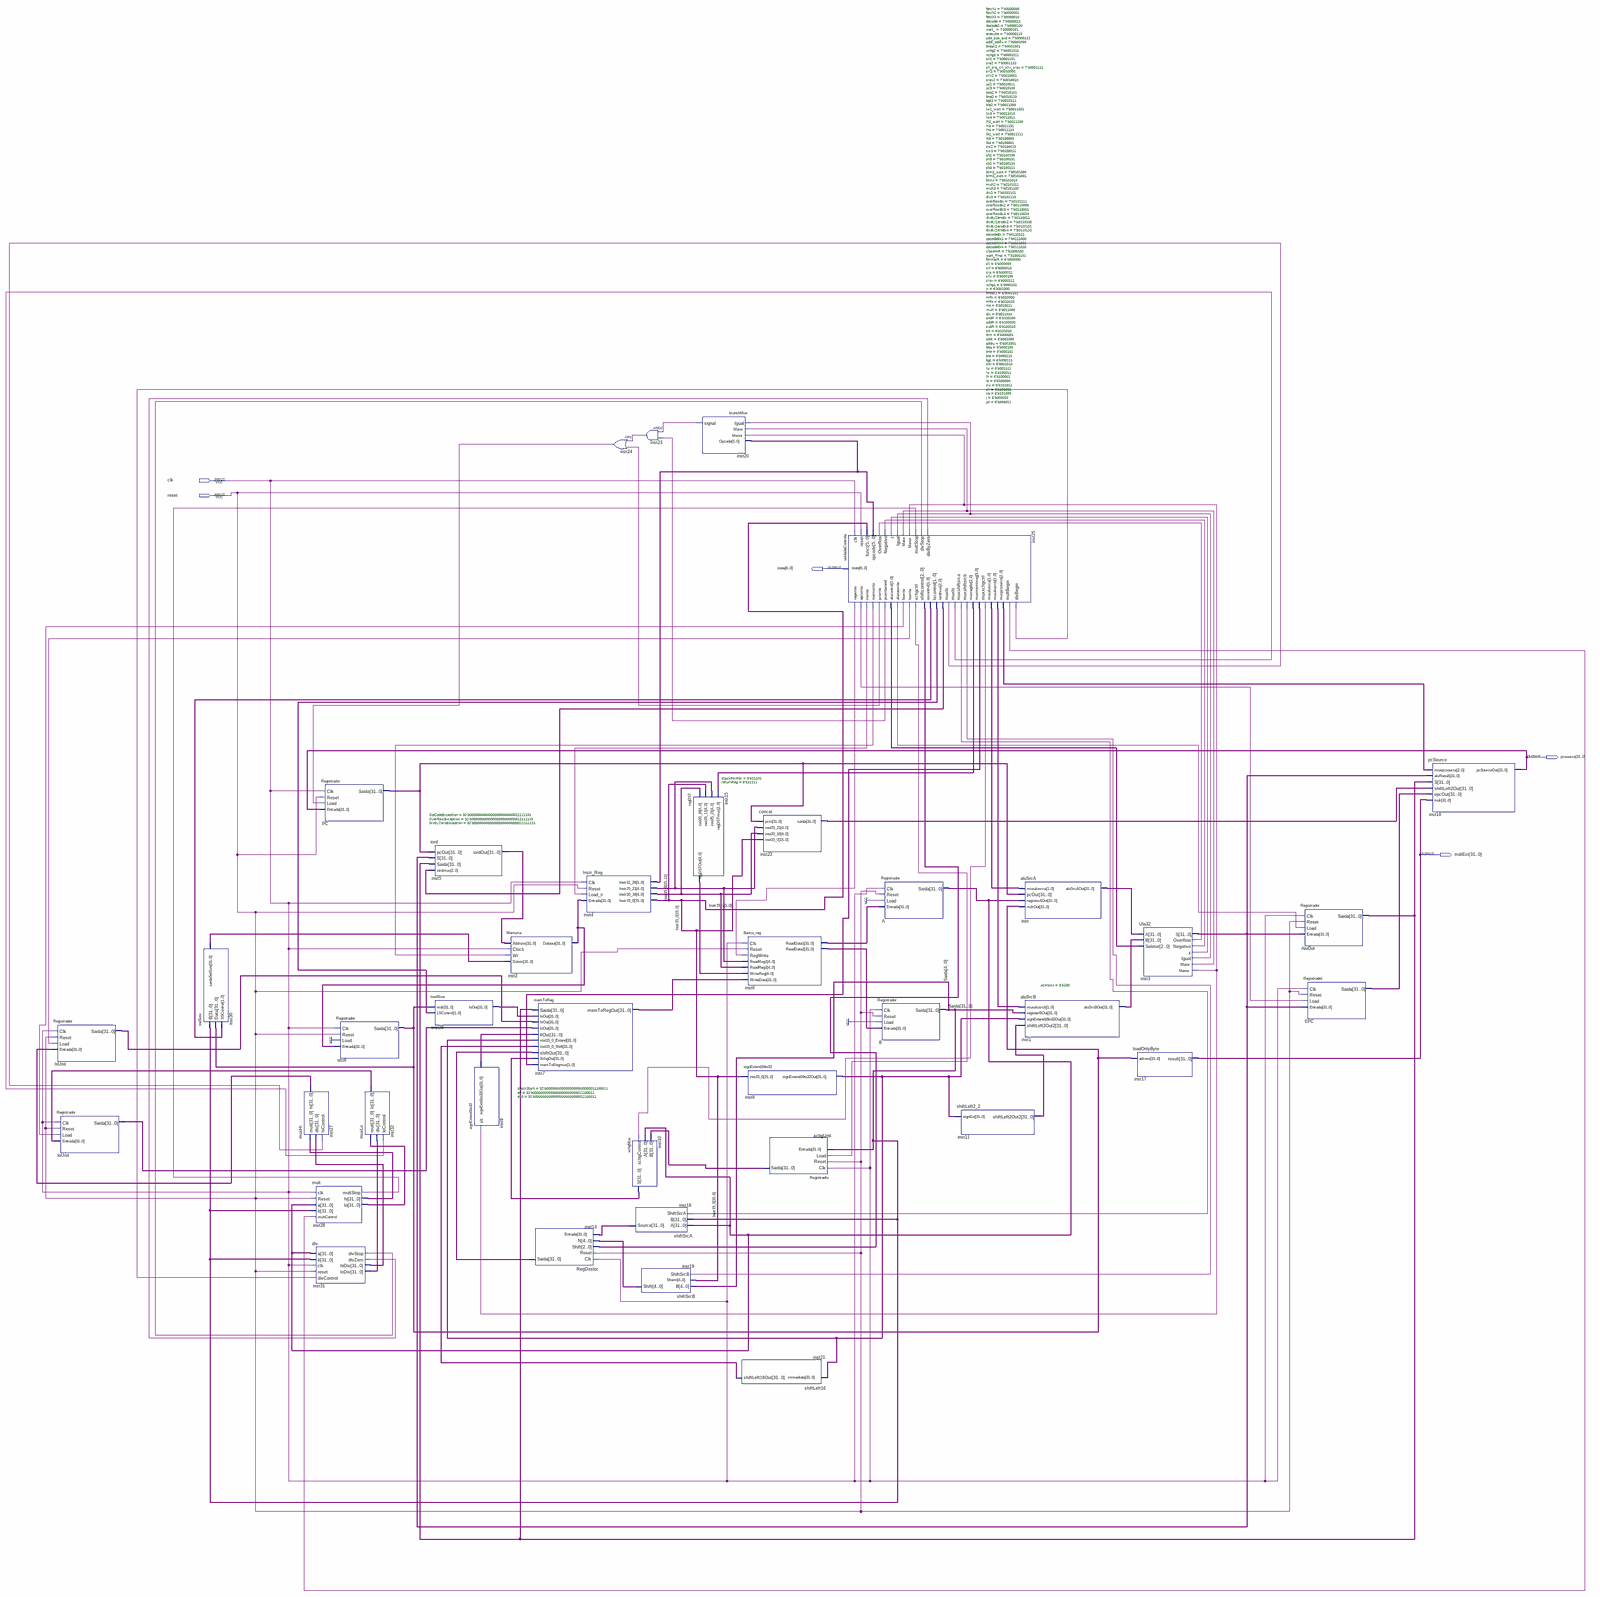
[diagram p0: schematic sheet, whole]
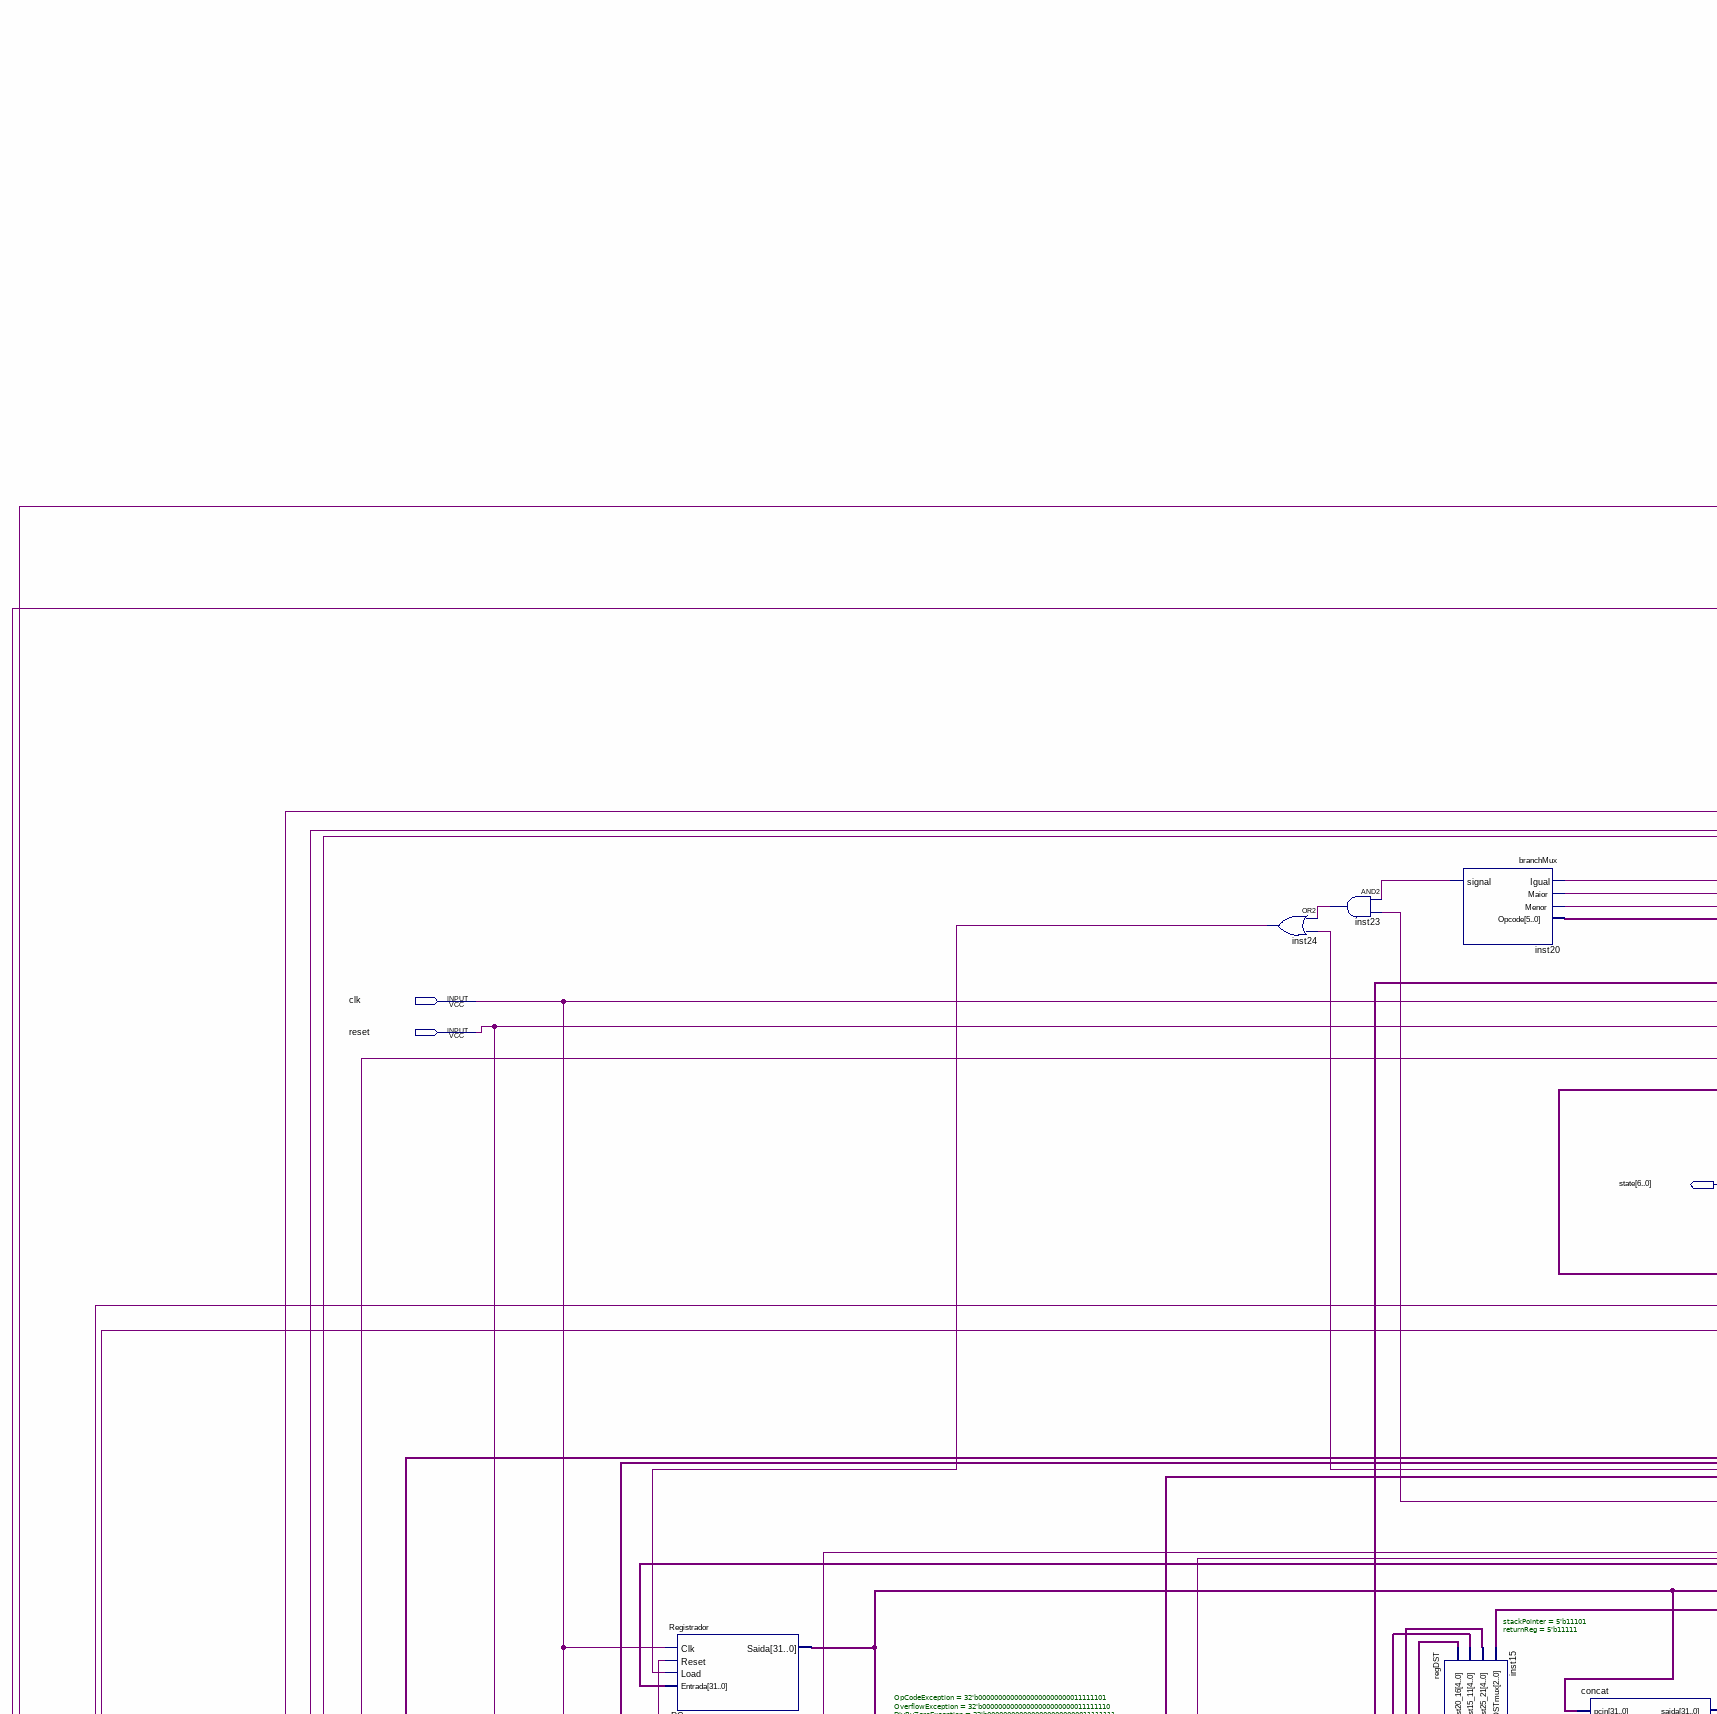
[diagram p1: schematic sheet, upper left part]
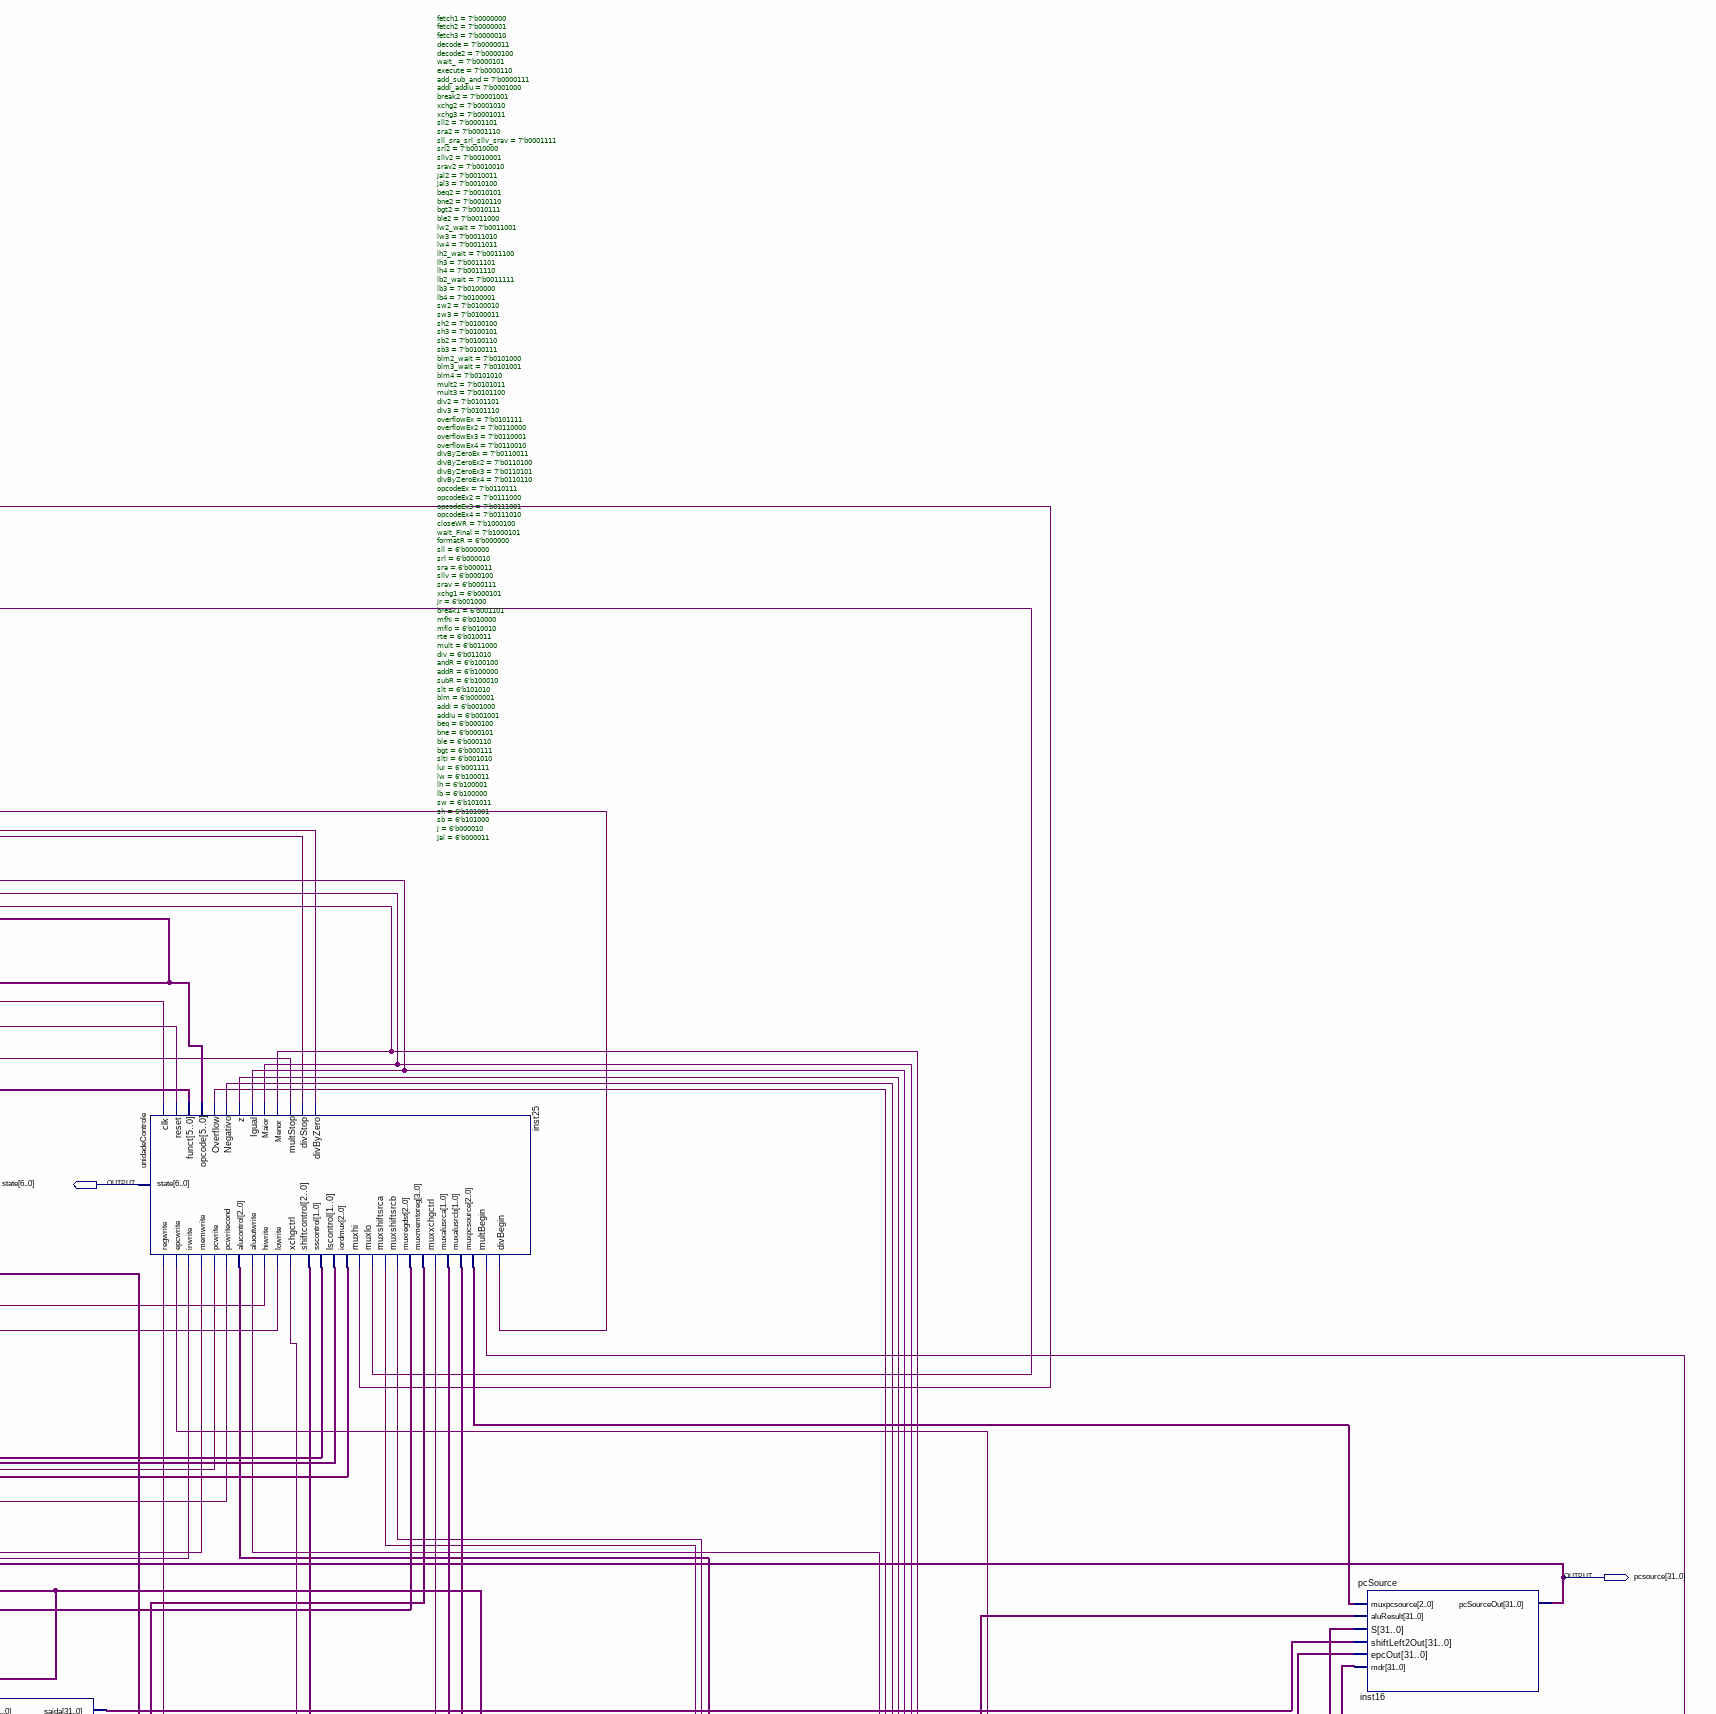
[diagram p2: schematic sheet, upper right part]
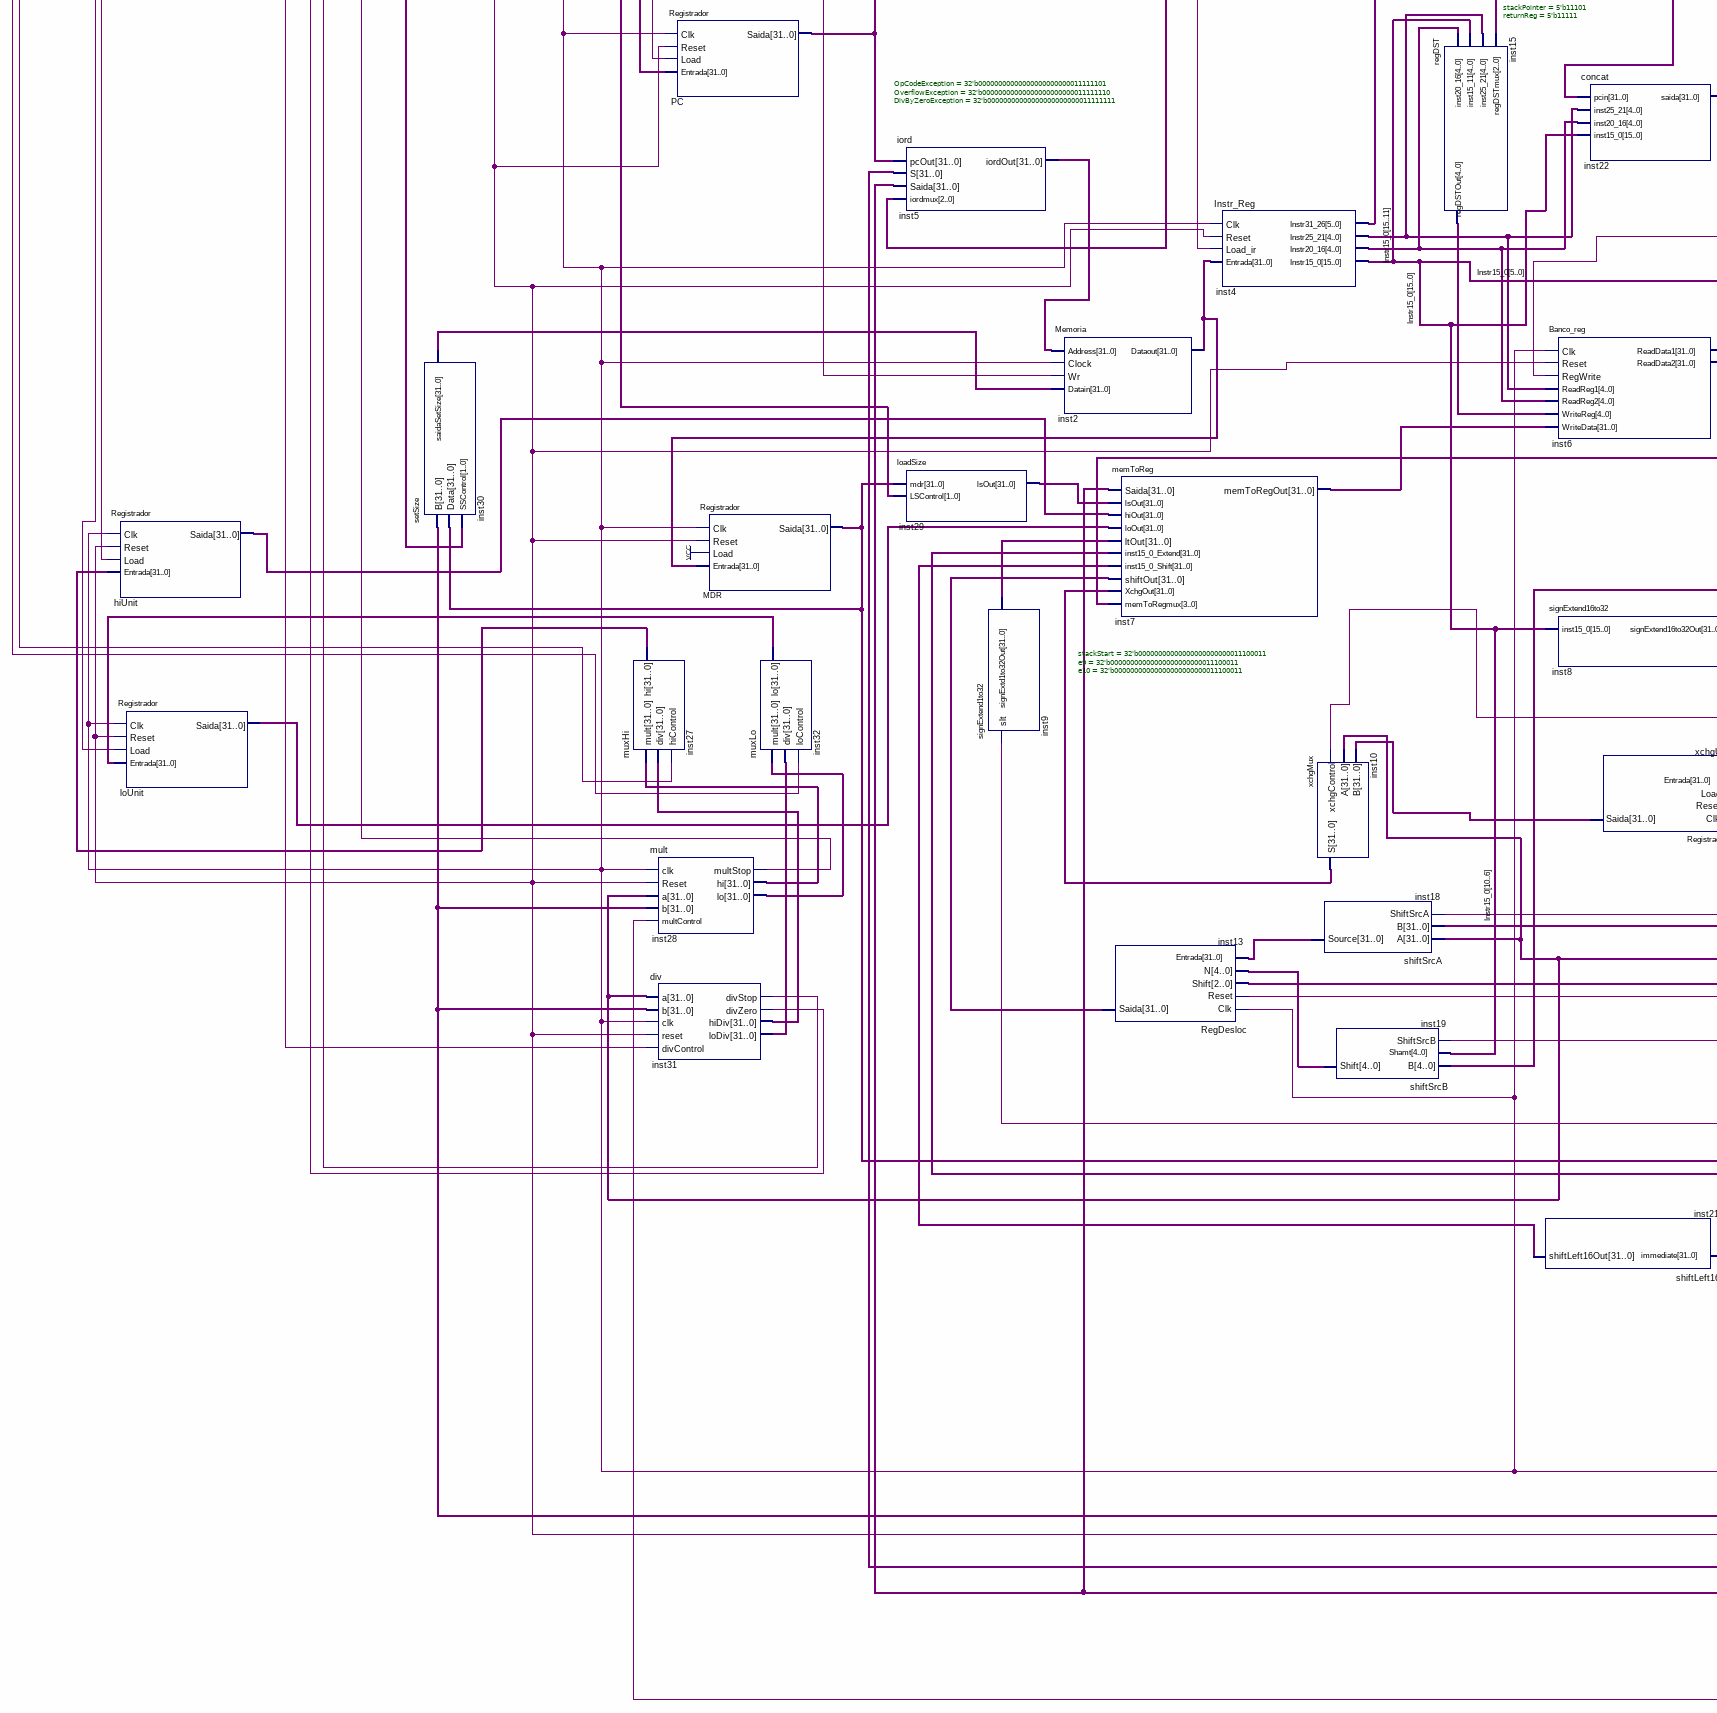
[diagram p3: schematic sheet, lower left part]
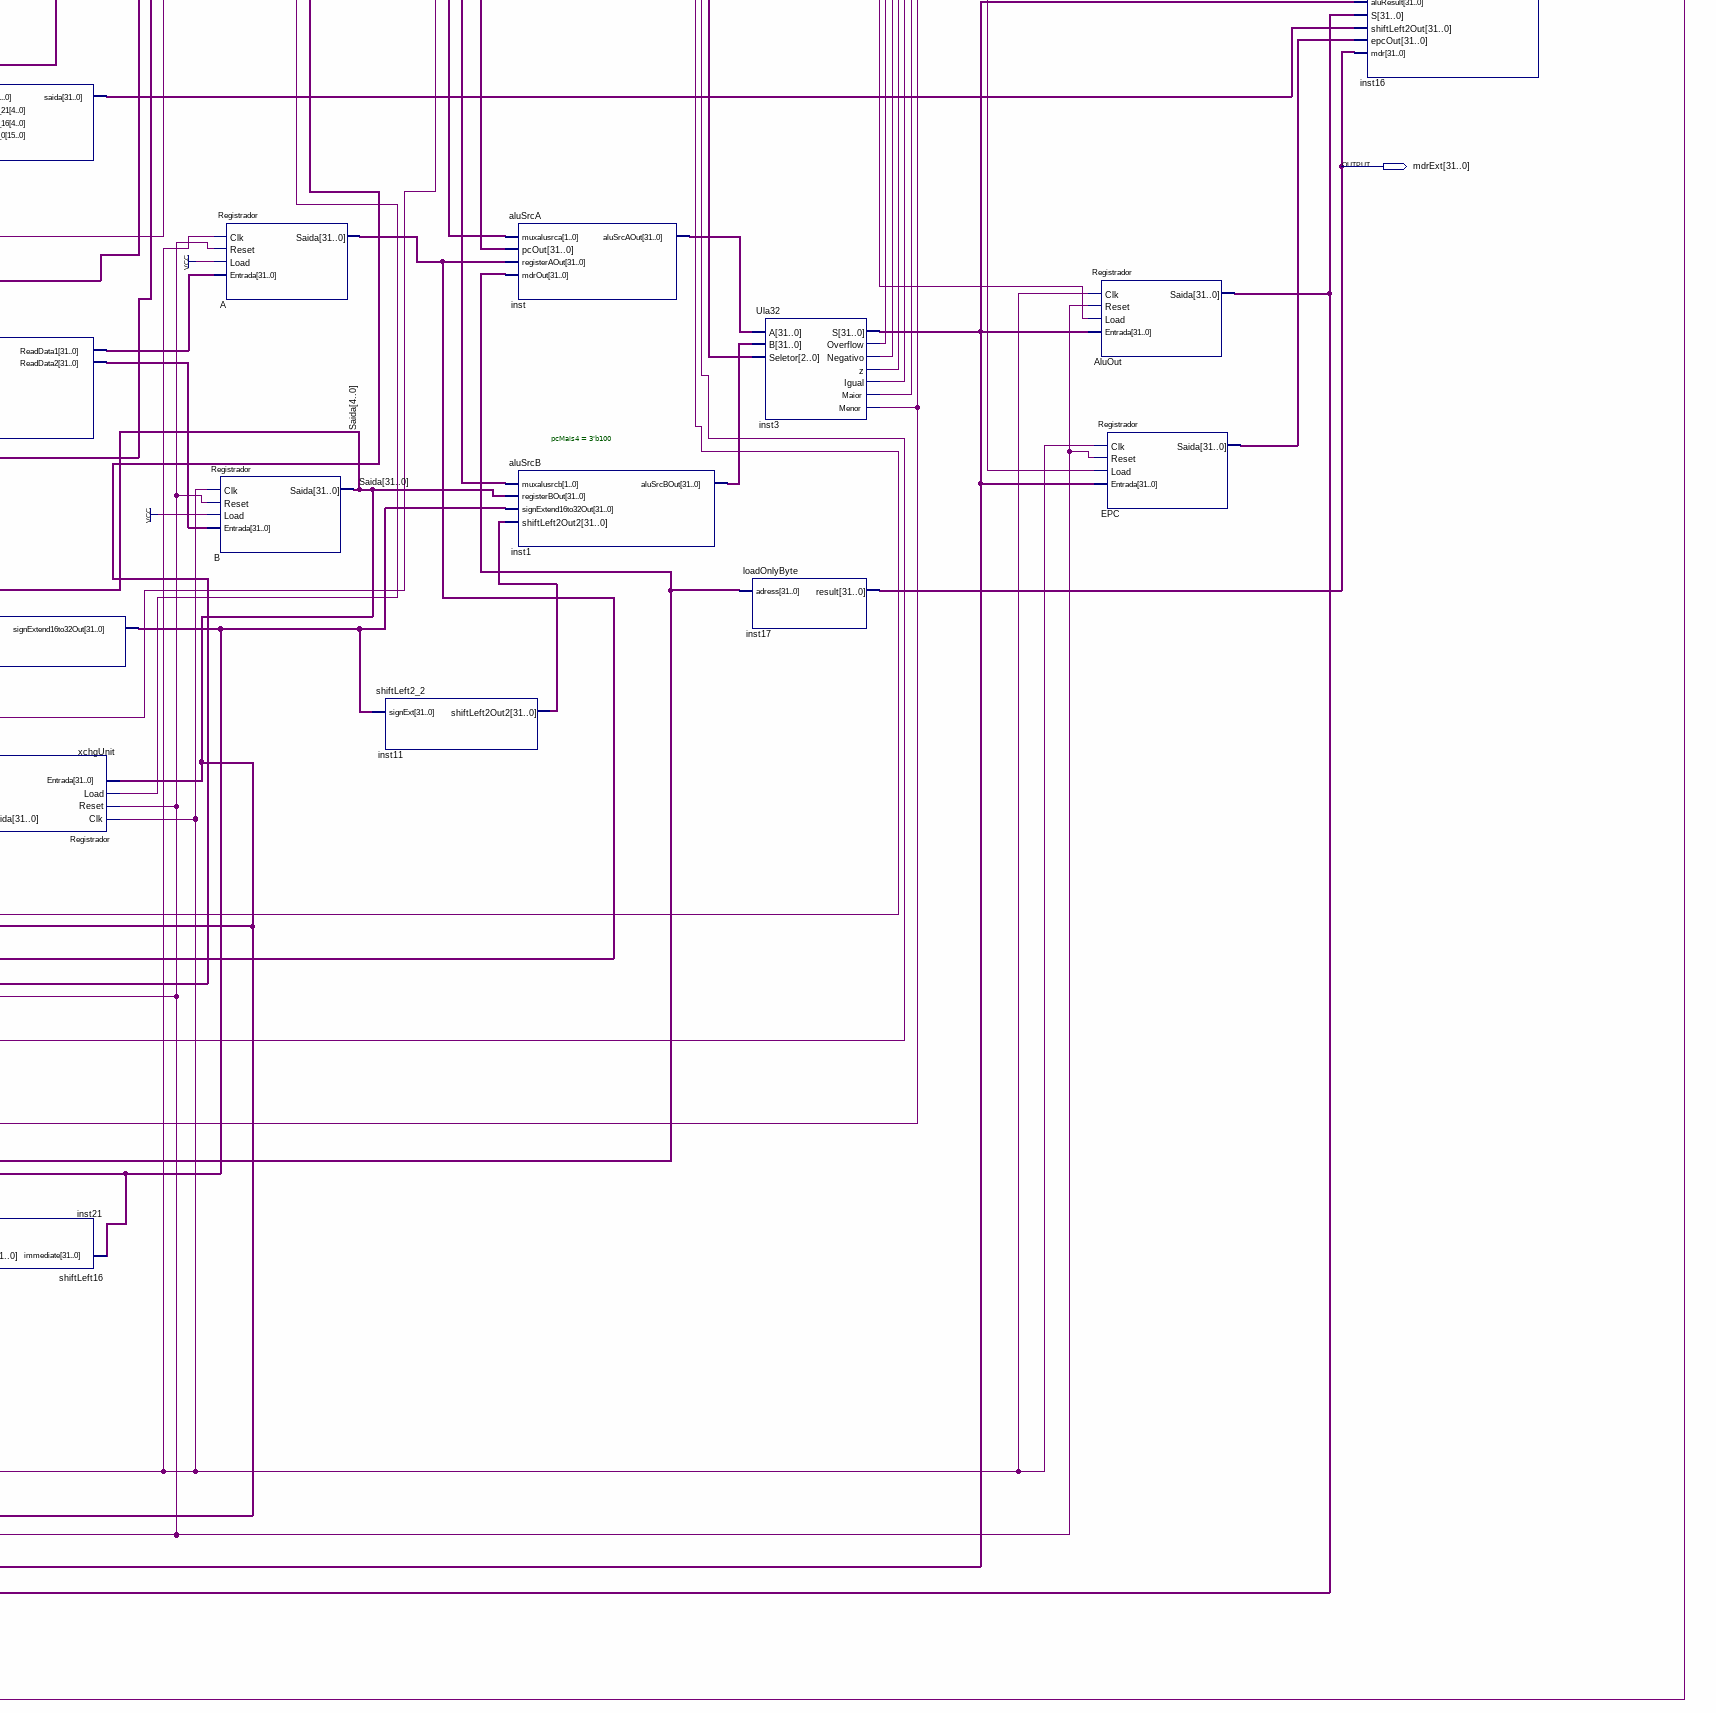
[diagram p4: schematic sheet, lower right part]
// Quartus schematic schemeHard.bdf as structural Verilog: 39 symbols, 5 pins
module schemeHard (
  input  clk,
  input  reset,
  output [6:0] state,
  output [31:0] pcsource,
  output [31:0] mdrExt
);

  wire inst3_igual, inst3_maior, inst3_menor, inst3_negativo, inst3_overflow, inst3_z, inst20_signal,
       inst23_out, inst24_out, inst25_aluoutwrite, inst25_divbegin, inst25_epcwrite, inst25_hiwrite,
       inst25_irwrite, inst25_lowrite, inst25_memwrite, inst25_multbegin, inst25_muxhi, inst25_muxlo,
       inst25_muxshiftsrca, inst25_muxshiftsrcb, inst25_muxxchgctrl, inst25_pcwrite, inst25_pcwritecond,
       inst25_regwrite, inst25_xchgctrl, inst28_multstop, inst31_divstop, inst31_divzero;
  wire [1:0] inst25_lscontrol, inst25_muxalusrca, inst25_muxalusrcb, inst25_sscontrol;
  wire [2:0] inst25_alucontrol, inst25_iordmux, inst25_muxpcsource, inst25_muxregdst, inst25_shiftcontrol;
  wire [3:0] inst25_muxmemtoreg;
  wire [4:0] inst4_instr20_16, inst4_instr25_21, inst15_regdstout, inst19_shift;
  wire [5:0] inst4_instr31_26;
  wire [15:0] Instr15_0;
  wire [31:0] A_saida, AluOut_saida, EPC_saida, hiUnit_saida, inst1_alusrcbout, inst2_dataout, inst3_s,
       inst5_iordout, inst6_readdata1, inst6_readdata2, inst7_memtoregout, inst8_signextend16to32out,
       inst9_signextd1to32out, inst10_s, inst11_shiftleft2out2, inst13_saida, inst18_source,
       inst21_shiftleft16out, inst22_saida, inst27_hi, inst28_hi, inst28_lo, inst29_lsout,
       inst30_saidasetsize, inst31_hidiv, inst31_lodiv, inst32_lo, inst_alusrcaout, loUnit_saida, MDR_saida,
       PC_saida, Saida, xchgUnit_saida;

  Registrador hiUnit (.Clk(clk), .Reset(reset), .Load(inst25_lowrite), .Entrada(inst27_hi), .Saida(hiUnit_saida));
  Registrador loUnit (.Clk(clk), .Reset(reset), .Load(inst25_hiwrite), .Entrada(inst32_lo), .Saida(loUnit_saida));
  setSize inst30 (.B(Saida), .Data(MDR_saida), .SSControl(inst25_sscontrol), .saidaSetSize(inst30_saidasetsize));
  muxHi inst27 (.mult(inst28_hi), .div(inst31_hidiv), .hiControl(inst25_muxhi), .hi(inst27_hi));
  Registrador PC (.Clk(clk), .Reset(reset), .Load(inst24_out), .Entrada(pcsource), .Saida(PC_saida));
  mult inst28 (
    .clk(clk), .Reset(reset), .a(A_saida), .b(Saida), .multControl(inst25_multbegin),
    .multStop(inst28_multstop), .hi(inst28_hi), .lo(inst28_lo));
  div inst31 (
    .a(A_saida), .b(Saida), .clk(clk), .reset(reset), .divControl(inst25_divbegin), .divStop(inst31_divstop),
    .divZero(inst31_divzero), .hiDiv(inst31_hidiv), .loDiv(inst31_lodiv));
  Registrador MDR (.Clk(clk), .Reset(reset), .Load(1'b1), .Entrada(inst2_dataout), .Saida(MDR_saida));
  muxLo inst32 (.mult(inst28_lo), .div(inst31_lodiv), .loControl(inst25_muxlo), .lo(inst32_lo));
  iord #(.OpCodeException(32'b00000000000000000000000011111101), .OverflowException(32'b00000000000000000000000011111110), .DivByZeroException(32'b00000000000000000000000011111111)) inst5 (
    .pcOut(PC_saida), .S(inst3_s), .Saida(AluOut_saida), .iordmux(inst25_iordmux), .iordOut(inst5_iordout));
  loadSize inst29 (.mdr(MDR_saida), .LSControl(inst25_lscontrol), .lsOut(inst29_lsout));
  signExtend1to32 inst9 (.slt(inst3_menor), .signExtd1to32Out(inst9_signextd1to32out));
  Memoria inst2 (
    .Address(inst5_iordout), .Clock(clk), .Wr(inst25_memwrite), .Datain(inst30_saidasetsize),
    .Dataout(inst2_dataout));
  memToReg #(.stackStart(32'b00000000000000000000000011100011), .e9(32'b00000000000000000000000011100011), .e10(32'b00000000000000000000000011100011)) inst7 (
    .Saida(AluOut_saida), .lsOut(inst29_lsout), .hiOut(hiUnit_saida), .loOut(loUnit_saida),
    .ltOut(inst9_signextd1to32out), .inst15_0_Extend(inst8_signextend16to32out),
    .inst15_0_Shift(inst21_shiftleft16out), .shiftOut(inst13_saida), .XchgOut(inst10_s),
    .memToRegmux(inst25_muxmemtoreg), .memToRegOut(inst7_memtoregout));
  RegDesloc inst13 (
    .Clk(clk), .Reset(reset), .Shift(inst25_shiftcontrol), .N(inst19_shift), .Entrada(inst18_source),
    .Saida(inst13_saida));
  Instr_Reg inst4 (
    .Clk(clk), .Reset(reset), .Load_ir(inst25_irwrite), .Entrada(inst2_dataout),
    .Instr31_26(inst4_instr31_26), .Instr25_21(inst4_instr25_21), .Instr20_16(inst4_instr20_16),
    .Instr15_0(Instr15_0));
  or inst24 (inst24_out, inst23_out, inst25_pcwrite);
  and inst23 (inst23_out, inst20_signal, inst25_pcwritecond);
  xchgMux inst10 (.xchgControl(inst25_muxxchgctrl), .A(A_saida), .B(xchgUnit_saida), .S(inst10_s));
  shiftSrcA inst18 (.A(A_saida), .B(Saida), .ShiftSrcA(inst25_muxshiftsrca), .Source(inst18_source));
  shiftSrcB inst19 (.B(Saida[4:0]), .Shamt(Instr15_0[10:6]), .ShiftSrcB(inst25_muxshiftsrcb), .Shift(inst19_shift));
  regDST #(.stackPointer(5'b11101), .returnReg(5'b11111)) inst15 (
    .inst20_16(inst4_instr20_16), .inst15_11(Instr15_0[15:11]), .inst25_21(inst4_instr25_21),
    .regDSTmux(inst25_muxregdst), .regDSTOut(inst15_regdstout));
  branchMux inst20 (
    .Igual(inst3_igual), .Maior(inst3_maior), .Menor(inst3_menor), .Opcode(inst4_instr31_26),
    .signal(inst20_signal));
  shiftLeft16 inst21 (.immediate(inst8_signextend16to32out), .shiftLeft16Out(inst21_shiftleft16out));
  concat inst22 (
    .pcin(PC_saida), .inst25_21(inst4_instr25_21), .inst20_16(inst4_instr20_16), .inst15_0(Instr15_0),
    .saida(inst22_saida));
  Banco_reg inst6 (
    .Clk(clk), .Reset(reset), .RegWrite(inst25_regwrite), .ReadReg1(inst4_instr25_21),
    .ReadReg2(inst4_instr20_16), .WriteReg(inst15_regdstout), .WriteData(inst7_memtoregout),
    .ReadData1(inst6_readdata1), .ReadData2(inst6_readdata2));
  signExtend16to32 inst8 (.inst15_0(Instr15_0), .signExtend16to32Out(inst8_signextend16to32out));
  Registrador xchgUnit (.Clk(clk), .Reset(reset), .Load(inst25_xchgctrl), .Entrada(Saida), .Saida(xchgUnit_saida));
  unidadeControle #(.fetch1(7'b0000000), .fetch2(7'b0000001), .fetch3(7'b0000010), .decode(7'b0000011), .decode2(7'b0000100), .wait_(7'b0000101), .execute(7'b0000110), .add_sub_and(7'b0000111), .addi_addiu(7'b0001000), .break2(7'b0001001), .xchg2(7'b0001010), .xchg3(7'b0001011), .sll2(7'b0001101), .sra2(7'b0001110), .sll_sra_srl_sllv_srav(7'b0001111), .srl2(7'b0010000), .sllv2(7'b0010001), .srav2(7'b0010010), .jal2(7'b0010011), .jal3(7'b0010100), .beq2(7'b0010101), .bne2(7'b0010110), .bgt2(7'b0010111), .ble2(7'b0011000), .lw2_wait(7'b0011001), .lw3(7'b0011010), .lw4(7'b0011011), .lh2_wait(7'b0011100), .lh3(7'b0011101), .lh4(7'b0011110), .lb2_wait(7'b0011111), .lb3(7'b0100000), .lb4(7'b0100001), .sw2(7'b0100010), .sw3(7'b0100011), .sh2(7'b0100100), .sh3(7'b0100101), .sb2(7'b0100110), .sb3(7'b0100111), .blm2_wait(7'b0101000), .blm3_wait(7'b0101001), .blm4(7'b0101010), .mult2(7'b0101011), .mult3(7'b0101100), .div2(7'b0101101), .div3(7'b0101110), .overflowEx(7'b0101111), .overflowEx2(7'b0110000), .overflowEx3(7'b0110001), .overflowEx4(7'b0110010), .divByZeroEx(7'b0110011), .divByZeroEx2(7'b0110100), .divByZeroEx3(7'b0110101), .divByZeroEx4(7'b0110110), .opcodeEx(7'b0110111), .opcodeEx2(7'b0111000), .opcodeEx3(7'b0111001), .opcodeEx4(7'b0111010), .closeWR(7'b1000100), .wait_Final(7'b1000101), .formatR(6'b000000), .sll(6'b000000), .srl(6'b000010), .sra(6'b000011), .sllv(6'b000100), .srav(6'b000111), .xchg1(6'b000101), .jr(6'b001000), .break1(6'b001101), .mfhi(6'b010000), .mflo(6'b010010), .rte(6'b010011), .mult(6'b011000), .div(6'b011010), .andR(6'b100100), .addR(6'b100000), .subR(6'b100010), .slt(6'b101010), .blm(6'b000001), .addi(6'b001000), .addiu(6'b001001), .beq(6'b000100), .bne(6'b000101), .ble(6'b000110), .bgt(6'b000111), .slti(6'b001010), .lui(6'b001111), .lw(6'b100011), .lh(6'b100001), .lb(6'b100000), .sw(6'b101011), .sh(6'b101001), .sb(6'b101000), .j(6'b000010), .jal(6'b000011)) inst25 (
    .clk(clk), .reset(reset), .funct(Instr15_0[5:0]), .opcode(inst4_instr31_26), .Overflow(inst3_overflow),
    .Negativo(inst3_negativo), .z(inst3_z), .Igual(inst3_igual), .Maior(inst3_maior), .Menor(inst3_menor),
    .multStop(inst28_multstop), .divStop(inst31_divstop), .divByZero(inst31_divzero),
    .regwrite(inst25_regwrite), .epcwrite(inst25_epcwrite), .irwrite(inst25_irwrite),
    .memwrite(inst25_memwrite), .pcwrite(inst25_pcwrite), .pcwritecond(inst25_pcwritecond),
    .alucontrol(inst25_alucontrol), .aluoutwrite(inst25_aluoutwrite), .hiwrite(inst25_hiwrite),
    .lowrite(inst25_lowrite), .xchgctrl(inst25_xchgctrl), .shiftcontrol(inst25_shiftcontrol),
    .sscontrol(inst25_sscontrol), .lscontrol(inst25_lscontrol), .iordmux(inst25_iordmux),
    .muxhi(inst25_muxhi), .muxlo(inst25_muxlo), .muxshiftsrca(inst25_muxshiftsrca),
    .muxshiftsrcb(inst25_muxshiftsrcb), .muxregdst(inst25_muxregdst), .muxmemtoreg(inst25_muxmemtoreg),
    .muxxchgctrl(inst25_muxxchgctrl), .muxalusrca(inst25_muxalusrca), .muxalusrcb(inst25_muxalusrcb),
    .muxpcsource(inst25_muxpcsource), .multBegin(inst25_multbegin), .divBegin(inst25_divbegin), .state(state));
  Registrador A (.Clk(clk), .Reset(reset), .Load(1'b1), .Entrada(inst6_readdata1), .Saida(A_saida));
  Registrador B (.Clk(clk), .Reset(reset), .Load(1'b1), .Entrada(inst6_readdata2), .Saida(Saida));
  shiftLeft2_2 inst11 (.signExt(inst8_signextend16to32out), .shiftLeft2Out2(inst11_shiftleft2out2));
  aluSrcA inst (
    .muxalusrca(inst25_muxalusrca), .pcOut(PC_saida), .registerAOut(A_saida), .mdrOut(MDR_saida),
    .aluSrcAOut(inst_alusrcaout));
  aluSrcB #(.pcMais4(3'b100)) inst1 (
    .muxalusrcb(inst25_muxalusrcb), .registerBOut(Saida), .signExtend16to32Out(inst8_signextend16to32out),
    .shiftLeft2Out2(inst11_shiftleft2out2), .aluSrcBOut(inst1_alusrcbout));
  Ula32 inst3 (
    .A(inst_alusrcaout), .B(inst1_alusrcbout), .Seletor(inst25_alucontrol), .S(inst3_s),
    .Overflow(inst3_overflow), .Negativo(inst3_negativo), .z(inst3_z), .Igual(inst3_igual),
    .Maior(inst3_maior), .Menor(inst3_menor));
  loadOnlyByte inst17 (.adress(MDR_saida), .result(mdrExt));
  Registrador AluOut (.Clk(clk), .Reset(reset), .Load(inst25_aluoutwrite), .Entrada(inst3_s), .Saida(AluOut_saida));
  Registrador EPC (.Clk(clk), .Reset(reset), .Load(inst25_epcwrite), .Entrada(inst3_s), .Saida(EPC_saida));
  pcSource inst16 (
    .muxpcsource(inst25_muxpcsource), .aluResult(inst3_s), .S(AluOut_saida), .shiftLeft2Out(inst22_saida),
    .epcOut(EPC_saida), .mdr(mdrExt), .pcSourceOut(pcsource));
endmodule
